# Altium schematic sheet VISION_BETA_EBB.SchDoc
size D; SheetNumber: 1; SheetTotal: 19
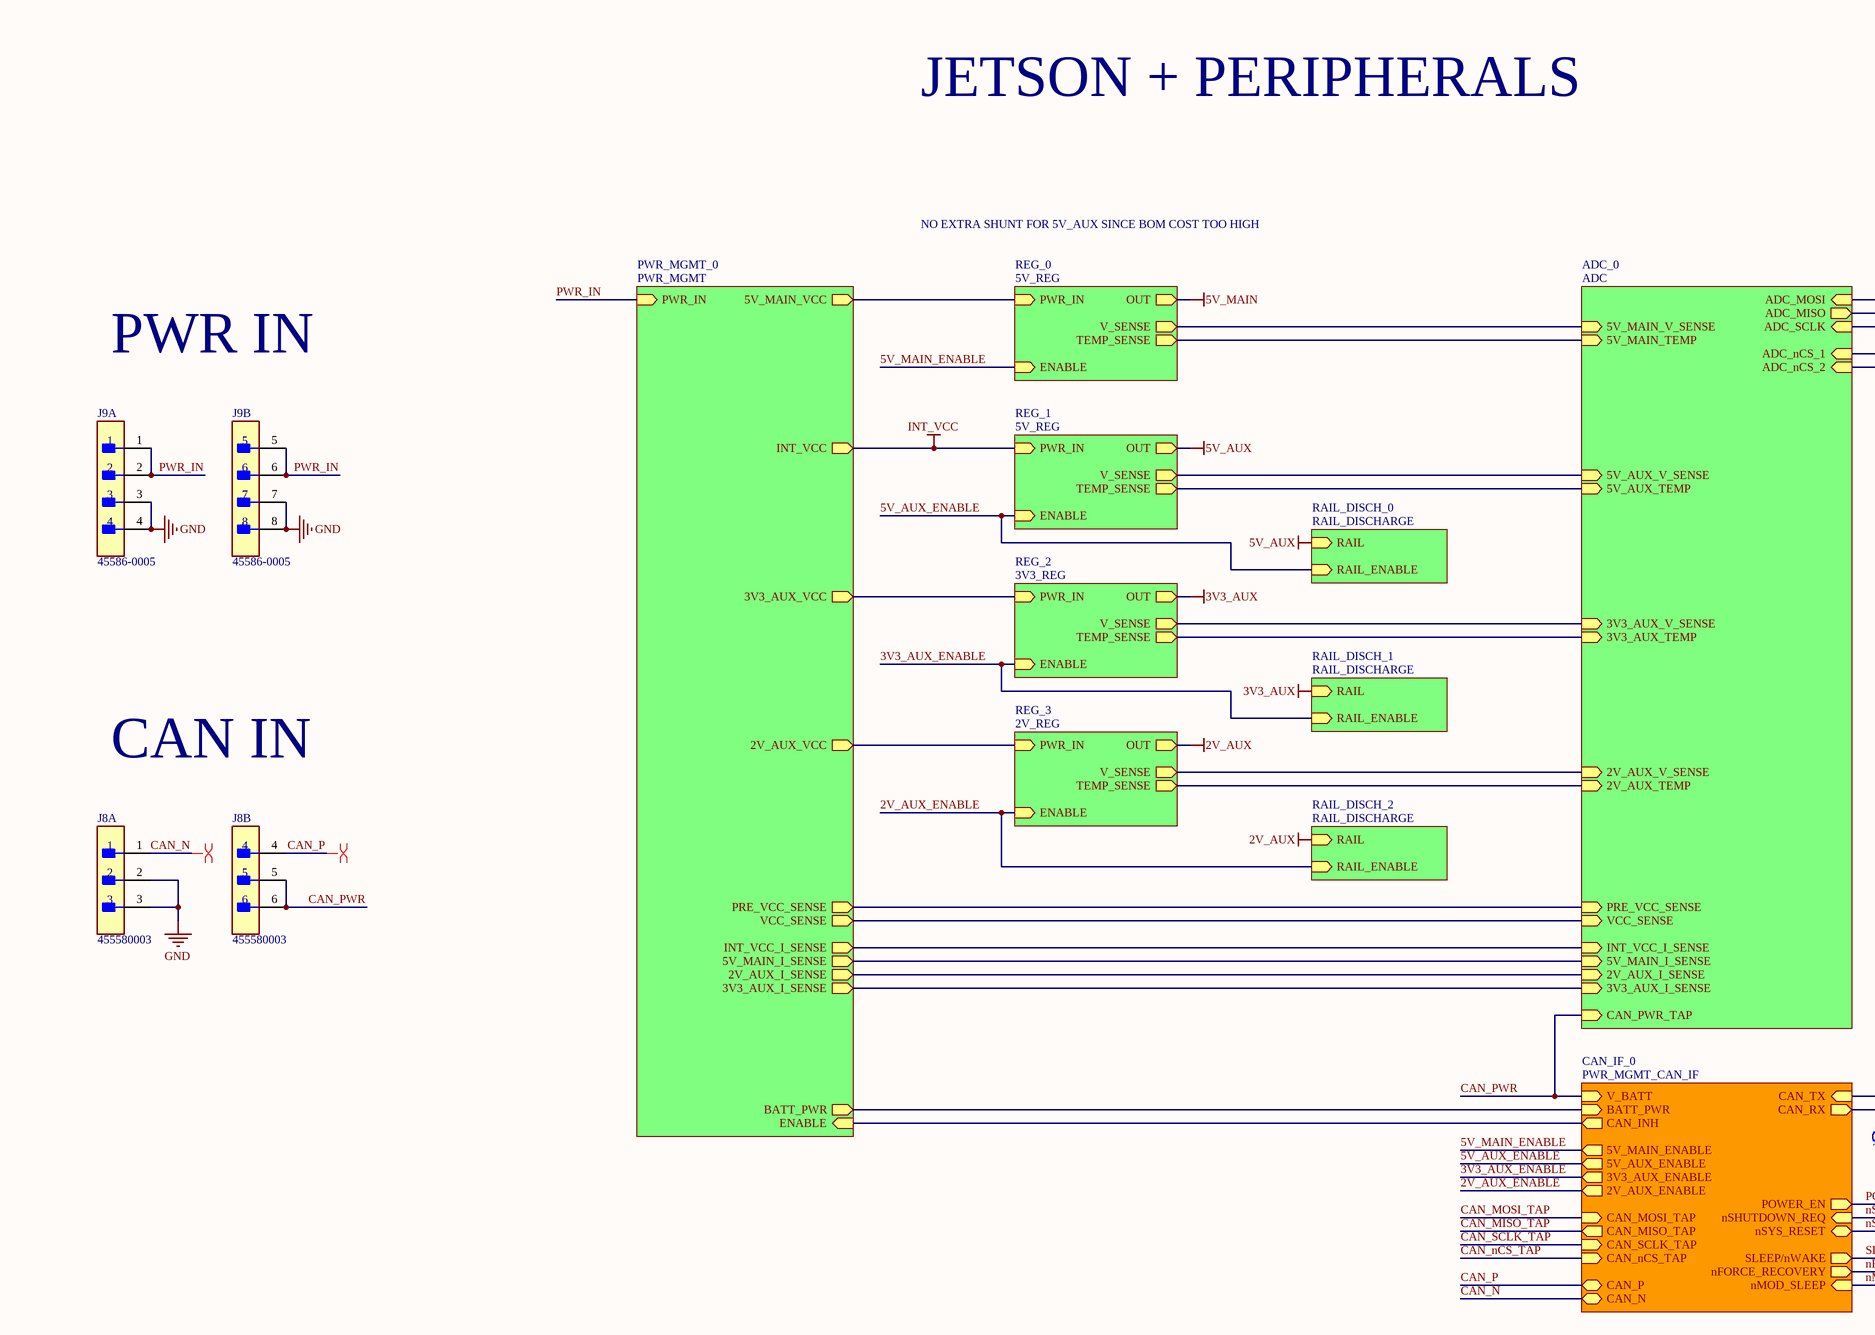
[diagram p0: VISION_BETA_EBB.SchDoc, top middle]
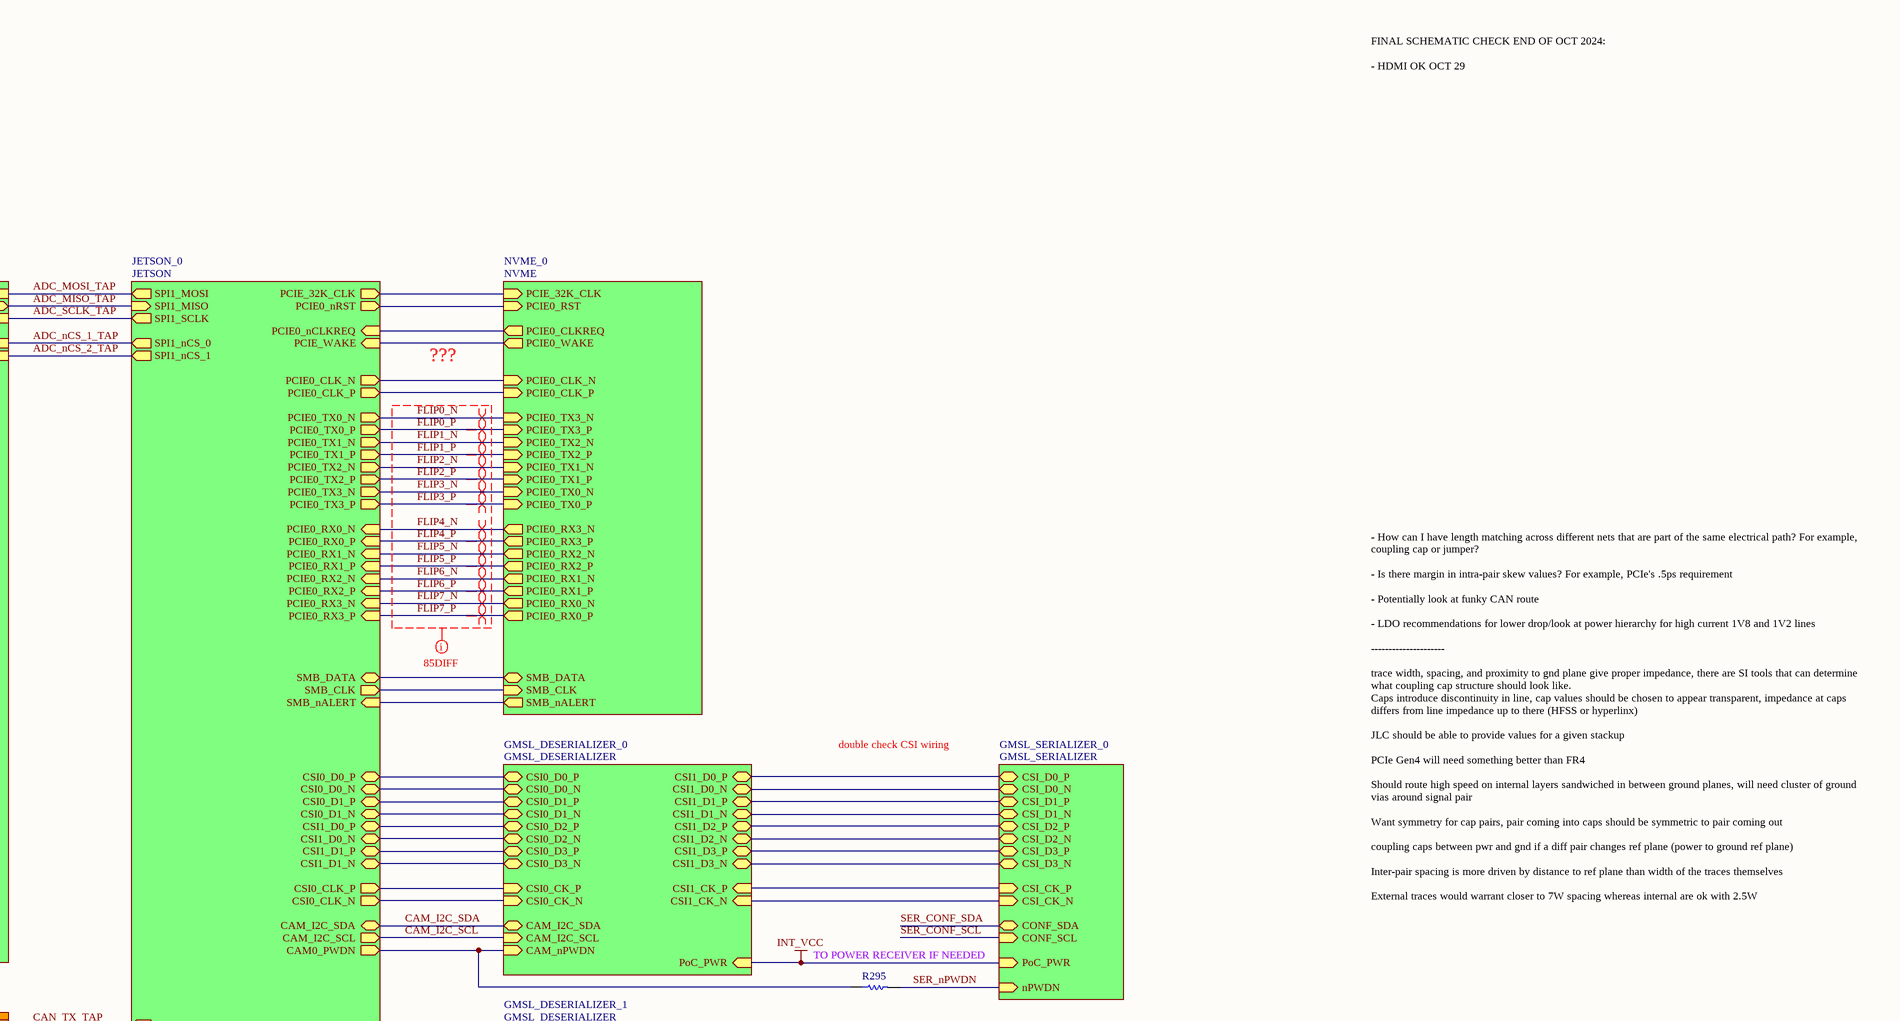
[diagram p1: VISION_BETA_EBB.SchDoc, top right]
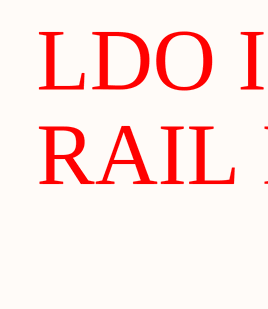
[diagram p2: VISION_BETA_EBB.SchDoc, bottom left]
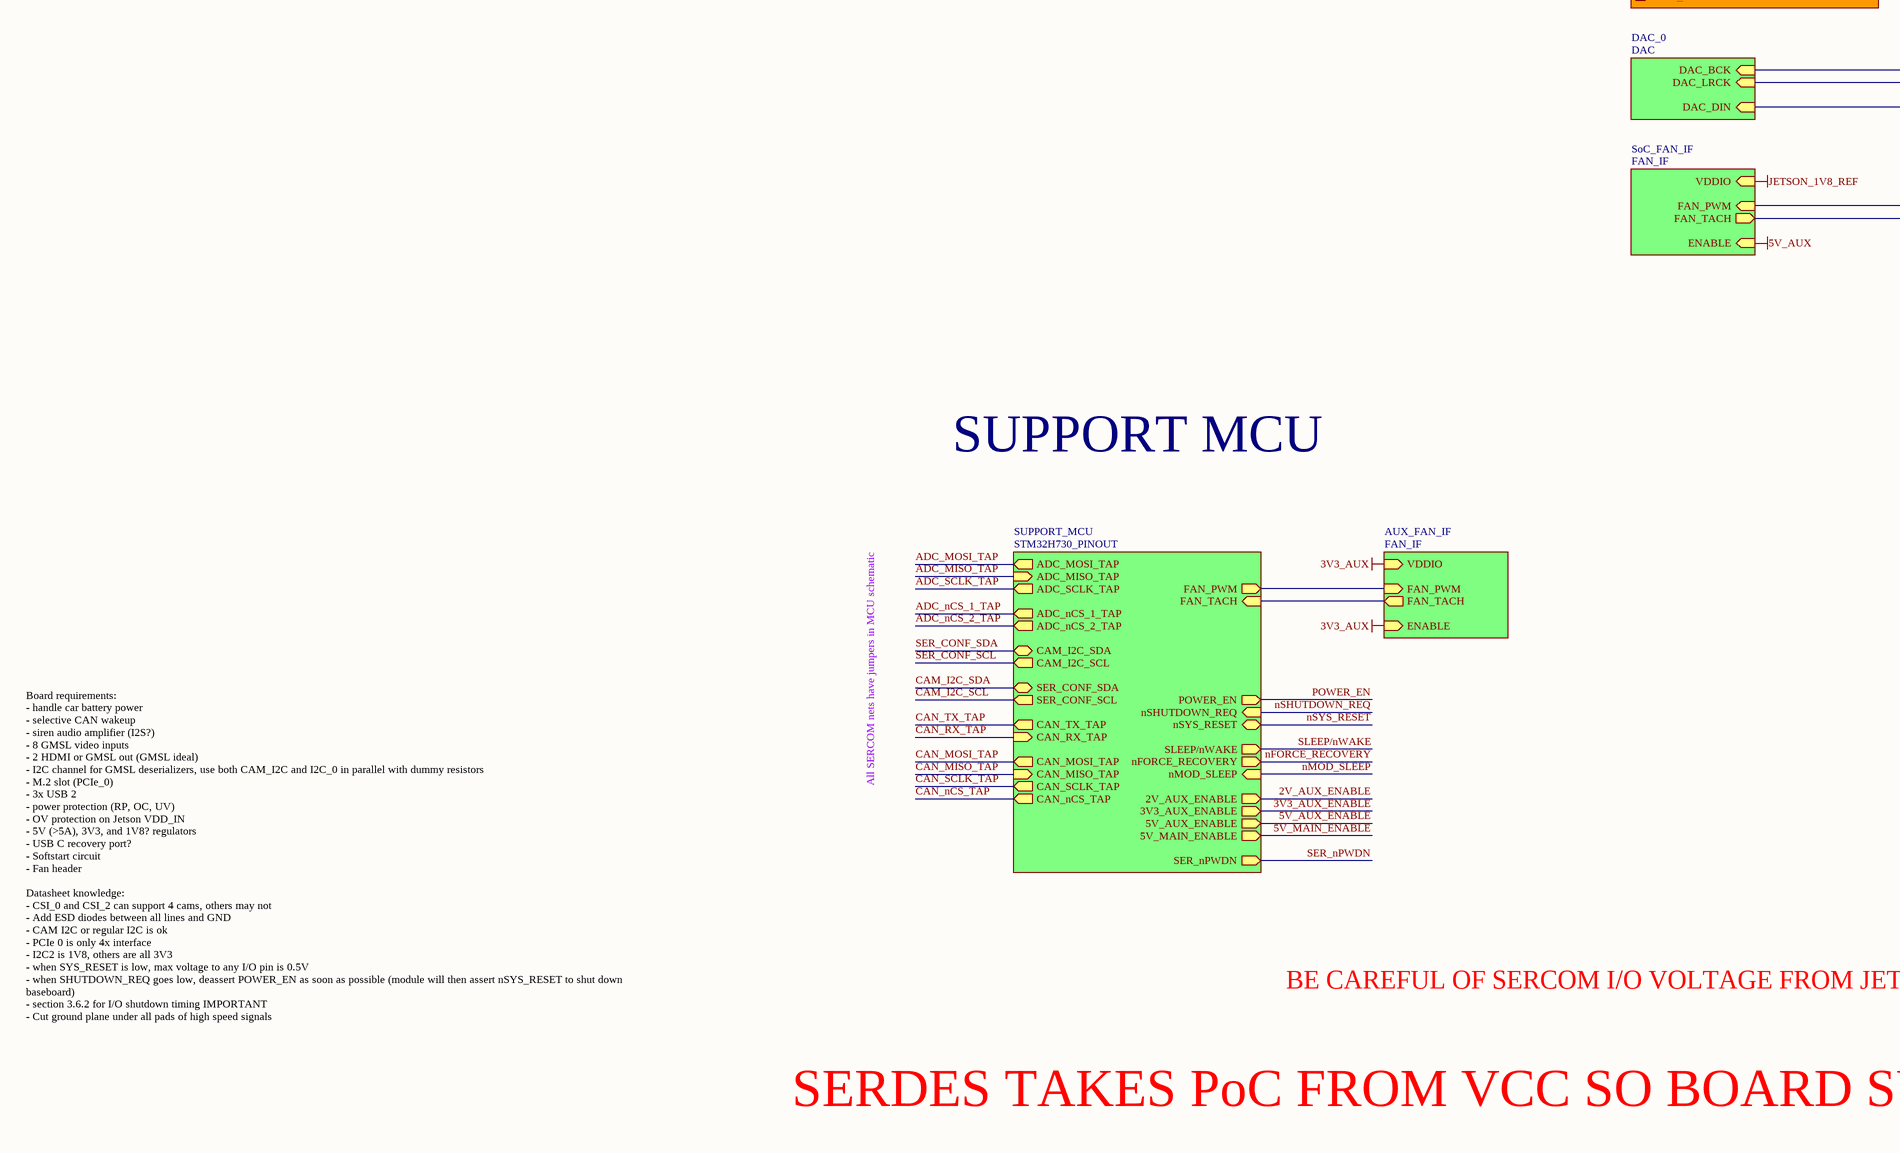
[diagram p3: VISION_BETA_EBB.SchDoc, bottom middle]
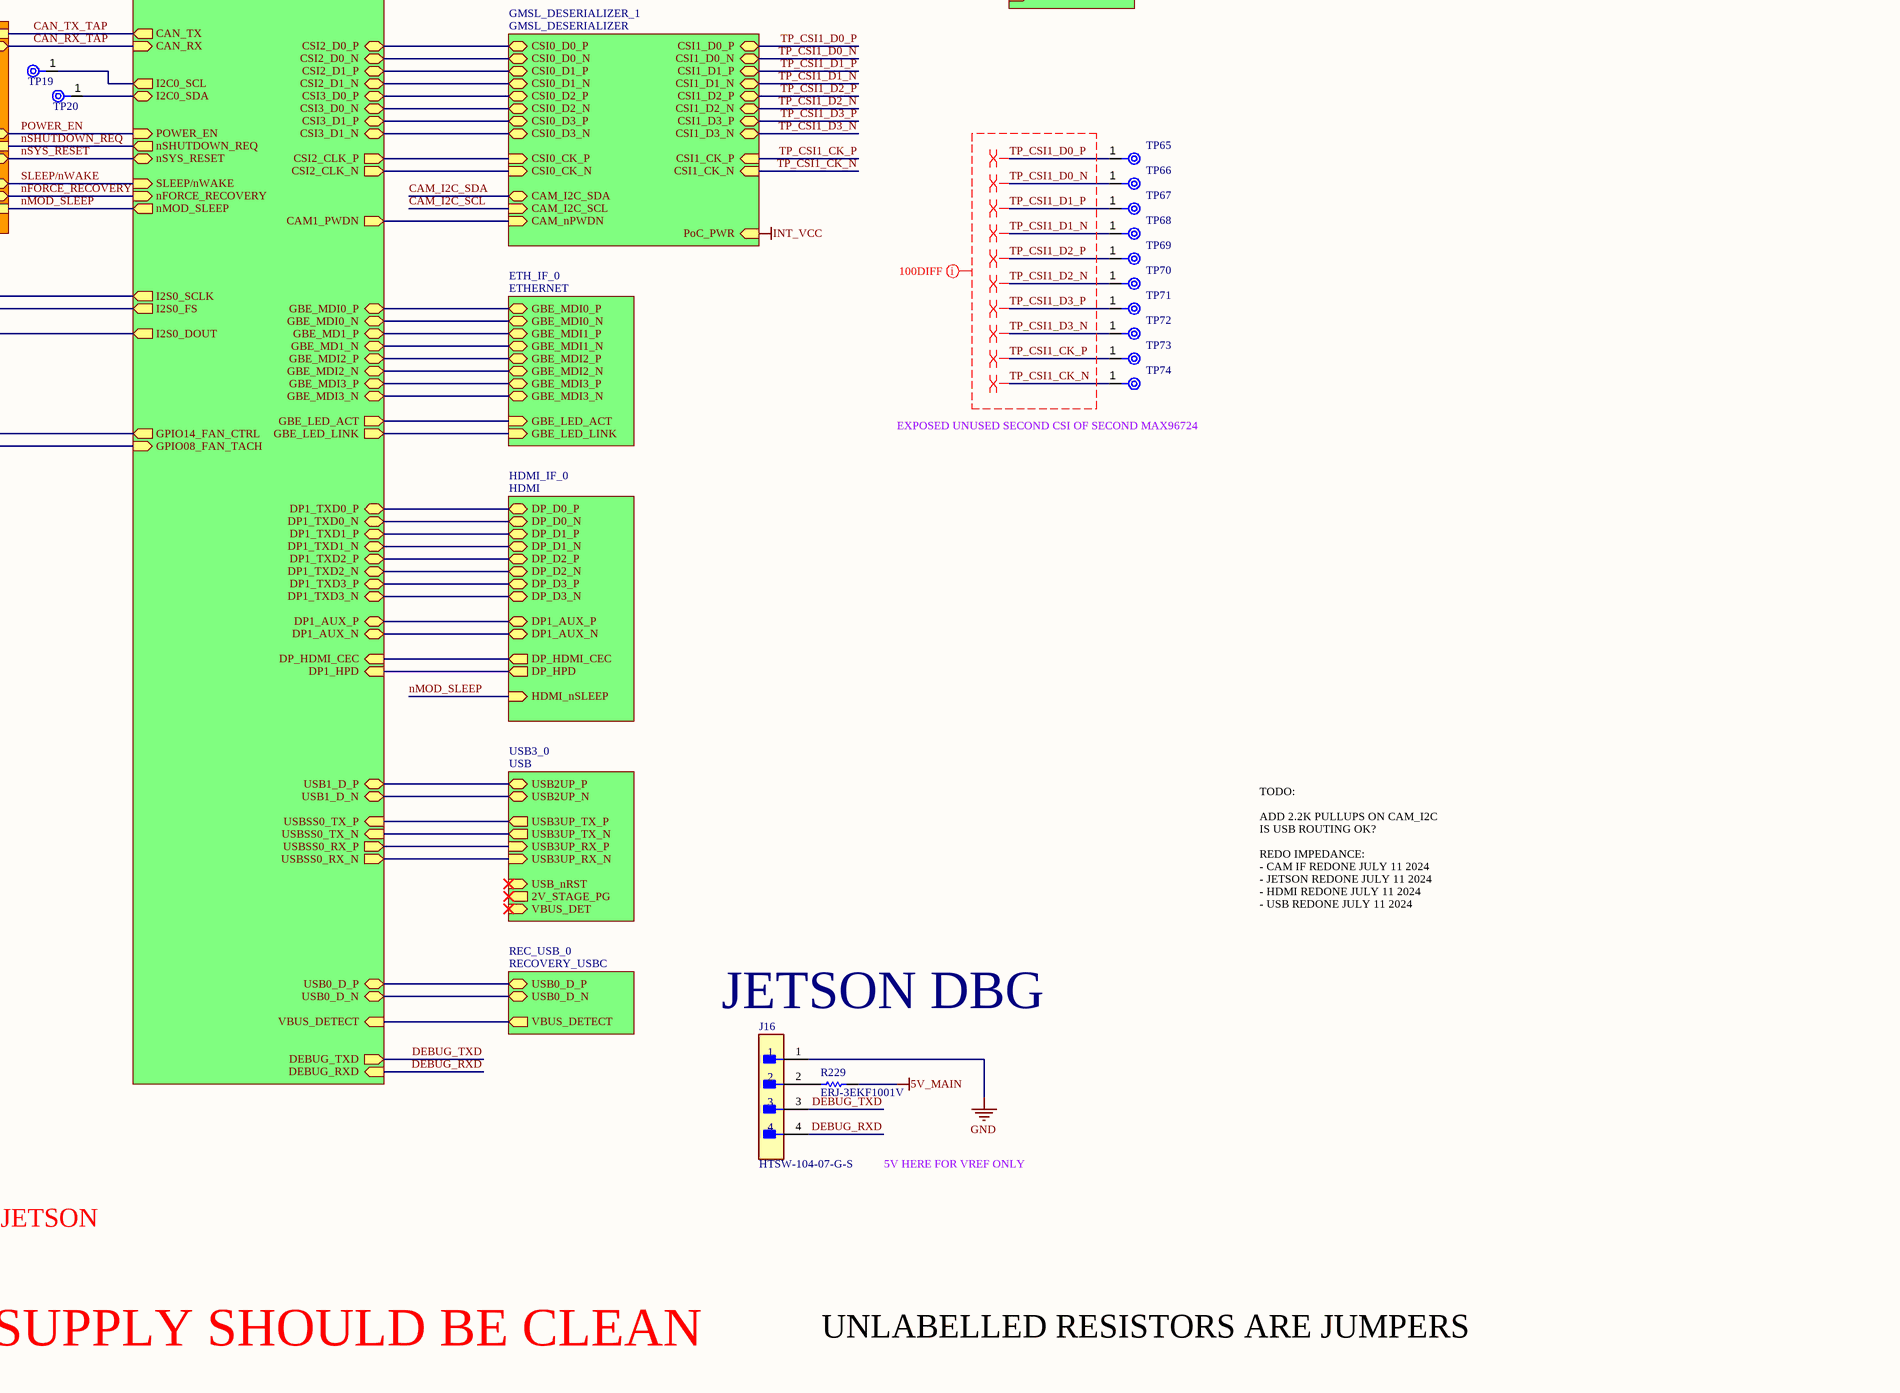
[diagram p4: VISION_BETA_EBB.SchDoc, bottom right]

## Parts
J8  455580003  [FP-455580003-MFG]  (parts A,B of 2)
J9  45586-0005  [FP-45586-0005-MFG]  (parts A,B of 2)
J16  HTSW-104-07-G-S  [FP-HTSW-104-07-G-S-MFG]
R229  ERJ-3EKF1001V  [RESC1608X55X30LL15T15]
R295  0402 JUMPER  [RESC1005X40X25ML05T05]  (value not drawn)
TP19  TPAD6R  [New footprint 1]  (value not drawn)
TP20  TPAD6R  [New footprint 1]  (value not drawn)
TP65  TPAD6R  [New footprint 1]  (value not drawn)
TP66  TPAD6R  [New footprint 1]  (value not drawn)
TP67  TPAD6R  [New footprint 1]  (value not drawn)
TP68  TPAD6R  [New footprint 1]  (value not drawn)
TP69  TPAD6R  [New footprint 1]  (value not drawn)
TP70  TPAD6R  [New footprint 1]  (value not drawn)
TP71  TPAD6R  [New footprint 1]  (value not drawn)
TP72  TPAD6R  [New footprint 1]  (value not drawn)
TP73  TPAD6R  [New footprint 1]  (value not drawn)
TP74  TPAD6R  [New footprint 1]  (value not drawn)

## Sub-sheets
ADC_0 = ADC: 5V_MAIN_V_SENSE (in), 3V3_AUX_V_SENSE (in), ADC_SCLK (in), ADC_MISO (out), ADC_MOSI (in), ADC_nCS_1 (in), ADC_nCS_2 (in), 2V_AUX_V_SENSE (in), 5V_AUX_V_SENSE (in), 5V_MAIN_TEMP (in), 5V_AUX_TEMP (in), 2V_AUX_TEMP (in), 3V3_AUX_TEMP (in), PRE_VCC_SENSE (in), VCC_SENSE (in), INT_VCC_I_SENSE (in), 5V_MAIN_I_SENSE (in), 2V_AUX_I_SENSE (in), 3V3_AUX_I_SENSE (in), CAN_PWR_TAP (in)
AUX_FAN_IF = FAN_IF: VDDIO (in), FAN_PWM (in), FAN_TACH (out), ENABLE (in)
CAN_IF_0 = PWR_MGMT_CAN_IF: CAN_TX (in), CAN_RX (out), CAN_INH (out), V_BATT (in), CAN_MOSI_TAP (in), CAN_MISO_TAP (out), CAN_SCLK_TAP (in), CAN_nCS_TAP (in), POWER_EN (out), nSHUTDOWN_REQ (in), nSYS_RESET (bidir), SLEEP/nWAKE (out), nFORCE_RECOVERY (out), nMOD_SLEEP (in), 5V_MAIN_ENABLE (out), 5V_AUX_ENABLE (out), 3V3_AUX_ENABLE (out), 2V_AUX_ENABLE (out), CAN_P (bidir), CAN_N (bidir), BATT_PWR (in)
DAC_0 = DAC: DAC_LRCK (in), DAC_BCK (in), DAC_DIN (in)
ETH_IF_0 = ETHERNET: GBE_MDI0_P (bidir), GBE_MDI0_N (bidir), GBE_MDI1_P (bidir), GBE_MDI1_N (bidir), GBE_MDI2_P (bidir), GBE_MDI2_N (bidir), GBE_MDI3_P (bidir), GBE_MDI3_N (bidir), GBE_LED_ACT (in), GBE_LED_LINK (in)
GMSL_DESERIALIZER_0 = GMSL_DESERIALIZER: CAM_I2C_SDA (bidir), CAM_I2C_SCL (in), PoC_PWR (in), CAM_nPWDN (in), CSI0_D0_P (bidir), CSI0_D0_N (bidir), CSI0_D1_P (bidir), CSI0_D1_N (bidir), CSI0_D2_P (bidir), CSI0_D2_N (bidir), CSI0_D3_P (bidir), CSI0_D3_N (bidir), CSI0_CK_P (in), CSI0_CK_N (in), CSI1_D0_P (bidir), CSI1_D0_N (bidir), CSI1_D1_P (bidir), CSI1_D1_N (bidir), CSI1_D2_P (bidir), CSI1_D2_N (bidir), CSI1_D3_P (bidir), CSI1_D3_N (bidir), CSI1_CK_P (in), CSI1_CK_N (in)
GMSL_DESERIALIZER_1 = GMSL_DESERIALIZER: CAM_I2C_SDA (bidir), CAM_I2C_SCL (in), PoC_PWR (in), CAM_nPWDN (in), CSI0_D0_P (bidir), CSI0_D0_N (bidir), CSI0_D1_P (bidir), CSI0_D1_N (bidir), CSI0_D2_P (bidir), CSI0_D2_N (bidir), CSI0_D3_P (bidir), CSI0_D3_N (bidir), CSI0_CK_P (in), CSI0_CK_N (in), CSI1_D0_P (bidir), CSI1_D0_N (bidir), CSI1_D1_P (bidir), CSI1_D1_N (bidir), CSI1_D2_P (bidir), CSI1_D2_N (bidir), CSI1_D3_P (bidir), CSI1_D3_N (bidir), CSI1_CK_P (in), CSI1_CK_N (in)
GMSL_SERIALIZER_0 = GMSL_SERIALIZER: CSI_D0_P (bidir), CSI_D0_N (bidir), CSI_D1_P (bidir), CSI_D1_N (bidir), CSI_D2_P (bidir), CSI_D2_N (bidir), CSI_D3_P (bidir), CSI_D3_N (bidir), CSI_CK_P (in), CSI_CK_N (in), CONF_SDA (bidir), CONF_SCL (in), nPWDN (in), PoC_PWR (in)
HDMI_IF_0 = HDMI: HDMI_nSLEEP (in), DP_D0_P (bidir), DP_D0_N (bidir), DP_D1_P (bidir), DP_D1_N (bidir), DP_D2_P (bidir), DP_D2_N (bidir), DP_D3_P (bidir), DP_D3_N (bidir), DP1_AUX_P (bidir), DP1_AUX_N (bidir), DP_HDMI_CEC (out), DP_HPD (out)
JETSON_0 = JETSON: PCIE0_RX0_N (in), PCIE0_RX0_P (in), PCIE0_RX1_N (in), PCIE0_RX1_P (in), PCIE0_RX2_N (in), PCIE0_RX2_P (in), PCIE0_RX3_N (in), PCIE0_RX3_P (in), PCIE0_TX0_N (out), PCIE0_TX0_P (out), PCIE0_TX1_N (out), PCIE0_TX1_P (out), PCIE0_TX2_N (out), PCIE0_TX2_P (out), PCIE0_TX3_N (out), PCIE0_TX3_P (out), PCIE0_CLK_N (out), PCIE0_CLK_P (out), CSI2_D0_N (bidir), CSI2_D0_P (bidir), CSI2_CLK_N (out), CSI2_CLK_P (out), CSI2_D1_N (bidir), CSI2_D1_P (bidir), CSI0_D0_N (bidir), CSI0_D0_P (bidir), CSI0_CLK_N (out), CSI0_CLK_P (out), CSI0_D1_N (bidir), CSI0_D1_P (bidir), CAM_I2C_SCL (out), CAM_I2C_SDA (bidir), CSI1_D0_N (bidir), CSI1_D0_P (bidir), CSI1_D1_N (bidir), CSI1_D1_P (bidir), CSI3_D0_N (bidir), CSI3_D0_P (bidir), CSI3_D1_N (bidir), CSI3_D1_P (bidir), DP1_TXD0_N (bidir), DP1_TXD0_P (bidir), DP1_TXD1_N (bidir), DP1_TXD1_P (bidir), DP1_TXD2_N (bidir), DP1_TXD2_P (bidir), DP1_TXD3_N (bidir), DP1_TXD3_P (bidir), DP1_AUX_N (bidir), DP1_AUX_P (bidir), DP_HDMI_CEC (in), DP1_HPD (in), PCIE_WAKE (in), PCIE0_nCLKREQ (in), PCIE0_nRST (out), CAM0_PWDN (out), CAM1_PWDN (out), CAN_RX (in), CAN_TX (out), PCIE_32K_CLK (out), SMB_DATA (bidir), SMB_CLK (out), SMB_nALERT (in), GBE_MDI0_N (bidir), GBE_MDI0_P (bidir), GBE_MD1_N (bidir), GBE_MD1_P (bidir), GBE_MDI2_N (bidir), GBE_MDI2_P (bidir), GBE_MDI3_N (bidir), GBE_MDI3_P (bidir), GBE_LED_ACT (out), GBE_LED_LINK (out), USB1_D_N (bidir), USB1_D_P (bidir), USBSS0_TX_N (in), USBSS0_TX_P (in), USBSS0_RX_N (out), USBSS0_RX_P (out), USB0_D_N (bidir), USB0_D_P (bidir), POWER_EN (in), nSHUTDOWN_REQ (out), nSYS_RESET (bidir), SLEEP/nWAKE (in), nFORCE_RECOVERY (in), nMOD_SLEEP (out), I2S0_DOUT (out), I2S0_FS (out), I2S0_SCLK (out), GPIO08_FAN_TACH (in), GPIO14_FAN_CTRL (out), VBUS_DETECT (in), I2C0_SCL (out), I2C0_SDA (bidir), DEBUG_TXD (out), DEBUG_RXD (in), SPI1_MOSI (out), SPI1_SCLK (out), SPI1_MISO (in), SPI1_nCS_0 (out), SPI1_nCS_1 (out)
NVME_0 = NVME: PCIE0_RST (in), PCIE0_CLKREQ (out), PCIE0_WAKE (out), PCIE0_CLK_N (in), PCIE0_CLK_P (in), PCIE_32K_CLK (in), PCIE0_TX3_N (in), PCIE0_TX3_P (in), PCIE0_TX2_N (in), PCIE0_TX2_P (in), PCIE0_TX1_N (in), PCIE0_TX1_P (in), PCIE0_TX0_N (in), PCIE0_TX0_P (in), PCIE0_RX3_N (out), PCIE0_RX3_P (out), PCIE0_RX2_N (out), PCIE0_RX2_P (out), PCIE0_RX1_N (out), PCIE0_RX1_P (out), PCIE0_RX0_N (out), PCIE0_RX0_P (out), SMB_DATA (bidir), SMB_CLK (in), SMB_nALERT (out)
PWR_MGMT_0 = PWR_MGMT: PWR_IN (in), INT_VCC (out), 5V_MAIN_VCC (out), 3V3_AUX_VCC (out), 2V_AUX_VCC (out), PRE_VCC_SENSE (out), VCC_SENSE (out), INT_VCC_I_SENSE (out), 5V_MAIN_I_SENSE (out), 2V_AUX_I_SENSE (out), 3V3_AUX_I_SENSE (out), ENABLE (in), BATT_PWR (out)
RAIL_DISCH_0 = RAIL_DISCHARGE: RAIL (in), RAIL_ENABLE (in)
RAIL_DISCH_1 = RAIL_DISCHARGE: RAIL (in), RAIL_ENABLE (in)
RAIL_DISCH_2 = RAIL_DISCHARGE: RAIL (in), RAIL_ENABLE (in)
REC_USB_0 = RECOVERY_USBC: USB0_D_N (bidir), USB0_D_P (bidir), VBUS_DETECT (out)
REG_0 = 5V_REG: PWR_IN (in), OUT (out), V_SENSE (out), ENABLE (in), TEMP_SENSE (out)
REG_1 = 5V_REG: OUT (out), PWR_IN (in), ENABLE (in), V_SENSE (out), TEMP_SENSE (out)
REG_2 = 3V3_REG: PWR_IN (in), OUT (out), V_SENSE (out), ENABLE (in), TEMP_SENSE (out)
REG_3 = 2V_REG: PWR_IN (in), OUT (out), V_SENSE (out), ENABLE (in), TEMP_SENSE (out)
SoC_FAN_IF = FAN_IF: FAN_PWM (in), FAN_TACH (out), VDDIO (in), ENABLE (in)
SUPPORT_MCU = STM32H730_PINOUT: FAN_PWM (out), FAN_TACH (in), CAM_I2C_SDA (bidir), CAM_I2C_SCL (out), SER_CONF_SDA (bidir), SER_CONF_SCL (out), CAN_TX_TAP (out), CAN_RX_TAP (in), CAN_MOSI_TAP (out), CAN_MISO_TAP (in), CAN_SCLK_TAP (out), CAN_nCS_TAP (out), ADC_nCS_2_TAP (out), ADC_nCS_1_TAP (out), ADC_SCLK_TAP (out), ADC_MISO_TAP (in), ADC_MOSI_TAP (out), POWER_EN (out), nSHUTDOWN_REQ (in), nSYS_RESET (bidir), SLEEP/nWAKE (out), nFORCE_RECOVERY (out), nMOD_SLEEP (in), SER_nPWDN (out), 2V_AUX_ENABLE (out), 3V3_AUX_ENABLE (out), 5V_AUX_ENABLE (out), 5V_MAIN_ENABLE (out)
USB3_0 = USB: USB2UP_N (bidir), USB2UP_P (bidir), USB3UP_RX_N (in), USB3UP_RX_P (in), USB3UP_TX_N (out), USB3UP_TX_P (out), VBUS_DET (in), USB_nRST (in), 2V_STAGE_PG (out)

## Nets
2V_AUX: sheet REG_3/OUT, sheet RAIL_DISCH_2/RAIL
3V3_AUX: sheet REG_2/OUT, sheet AUX_FAN_IF/VDDIO, sheet AUX_FAN_IF/ENABLE, sheet RAIL_DISCH_1/RAIL
5V_AUX: sheet SoC_FAN_IF/ENABLE, sheet REG_1/OUT, sheet RAIL_DISCH_0/RAIL
5V_MAIN: R229.1 ; sheet REG_0/OUT
GND: J8.2 J8.3 J9.3 J9.4 J9.7 J9.8 J16.1
INT_VCC: sheet GMSL_DESERIALIZER_0/PoC_PWR, sheet GMSL_DESERIALIZER_1/PoC_PWR, sheet PWR_MGMT_0/INT_VCC, sheet GMSL_SERIALIZER_0/PoC_PWR, sheet REG_1/PWR_IN
JETSON_1V8_REF: sheet SoC_FAN_IF/VDDIO
2V_AUX_ENABLE: sheet REG_3/ENABLE, sheet CAN_IF_0/2V_AUX_ENABLE, sheet SUPPORT_MCU/2V_AUX_ENABLE, sheet RAIL_DISCH_2/RAIL_ENABLE
3V3_AUX_ENABLE: sheet REG_2/ENABLE, sheet CAN_IF_0/3V3_AUX_ENABLE, sheet SUPPORT_MCU/3V3_AUX_ENABLE, sheet RAIL_DISCH_1/RAIL_ENABLE
5V_AUX_ENABLE: sheet CAN_IF_0/5V_AUX_ENABLE, sheet REG_1/ENABLE, sheet SUPPORT_MCU/5V_AUX_ENABLE, sheet RAIL_DISCH_0/RAIL_ENABLE
5V_MAIN_ENABLE: sheet REG_0/ENABLE, sheet CAN_IF_0/5V_MAIN_ENABLE, sheet SUPPORT_MCU/5V_MAIN_ENABLE
ADC_MISO_TAP: sheet JETSON_0/SPI1_MISO, sheet ADC_0/ADC_MISO, sheet SUPPORT_MCU/ADC_MISO_TAP
ADC_MOSI_TAP: sheet JETSON_0/SPI1_MOSI, sheet ADC_0/ADC_MOSI, sheet SUPPORT_MCU/ADC_MOSI_TAP
ADC_nCS_1_TAP: sheet JETSON_0/SPI1_nCS_0, sheet ADC_0/ADC_nCS_1, sheet SUPPORT_MCU/ADC_nCS_1_TAP
ADC_nCS_2_TAP: sheet JETSON_0/SPI1_nCS_1, sheet ADC_0/ADC_nCS_2, sheet SUPPORT_MCU/ADC_nCS_2_TAP
ADC_SCLK_TAP: sheet JETSON_0/SPI1_SCLK, sheet ADC_0/ADC_SCLK, sheet SUPPORT_MCU/ADC_SCLK_TAP
CAM_I2C_SCL: sheet JETSON_0/CAM_I2C_SCL, sheet GMSL_DESERIALIZER_0/CAM_I2C_SCL, sheet GMSL_DESERIALIZER_1/CAM_I2C_SCL, sheet SUPPORT_MCU/SER_CONF_SCL
CAM_I2C_SDA: sheet JETSON_0/CAM_I2C_SDA, sheet GMSL_DESERIALIZER_0/CAM_I2C_SDA, sheet GMSL_DESERIALIZER_1/CAM_I2C_SDA, sheet SUPPORT_MCU/SER_CONF_SDA
CAN_MISO_TAP: sheet CAN_IF_0/CAN_MISO_TAP, sheet SUPPORT_MCU/CAN_MISO_TAP
CAN_MOSI_TAP: sheet CAN_IF_0/CAN_MOSI_TAP, sheet SUPPORT_MCU/CAN_MOSI_TAP
CAN_N: J8.1 ; sheet CAN_IF_0/CAN_N
CAN_nCS_TAP: sheet CAN_IF_0/CAN_nCS_TAP, sheet SUPPORT_MCU/CAN_nCS_TAP
CAN_P: J8.4 ; sheet CAN_IF_0/CAN_P
CAN_PWR: J8.5 J8.6 ; sheet ADC_0/CAN_PWR_TAP, sheet CAN_IF_0/V_BATT
CAN_RX_TAP: sheet JETSON_0/CAN_RX, sheet CAN_IF_0/CAN_RX, sheet SUPPORT_MCU/CAN_RX_TAP
CAN_SCLK_TAP: sheet CAN_IF_0/CAN_SCLK_TAP, sheet SUPPORT_MCU/CAN_SCLK_TAP
CAN_TX_TAP: sheet JETSON_0/CAN_TX, sheet CAN_IF_0/CAN_TX, sheet SUPPORT_MCU/CAN_TX_TAP
DEBUG_RXD: J16.4 ; sheet JETSON_0/DEBUG_RXD
DEBUG_TXD: J16.3 ; sheet JETSON_0/DEBUG_TXD
FLIP0_N: sheet JETSON_0/PCIE0_TX0_N, sheet NVME_0/PCIE0_TX3_N
FLIP0_P: sheet JETSON_0/PCIE0_TX0_P, sheet NVME_0/PCIE0_TX3_P
FLIP1_N: sheet JETSON_0/PCIE0_TX1_N, sheet NVME_0/PCIE0_TX2_N
FLIP1_P: sheet JETSON_0/PCIE0_TX1_P, sheet NVME_0/PCIE0_TX2_P
FLIP2_N: sheet JETSON_0/PCIE0_TX2_N, sheet NVME_0/PCIE0_TX1_N
FLIP2_P: sheet JETSON_0/PCIE0_TX2_P, sheet NVME_0/PCIE0_TX1_P
FLIP3_N: sheet JETSON_0/PCIE0_TX3_N, sheet NVME_0/PCIE0_TX0_N
FLIP3_P: sheet JETSON_0/PCIE0_TX3_P, sheet NVME_0/PCIE0_TX0_P
FLIP4_N: sheet JETSON_0/PCIE0_RX0_N, sheet NVME_0/PCIE0_RX3_N
FLIP4_P: sheet JETSON_0/PCIE0_RX0_P, sheet NVME_0/PCIE0_RX3_P
FLIP5_N: sheet JETSON_0/PCIE0_RX1_N, sheet NVME_0/PCIE0_RX2_N
FLIP5_P: sheet JETSON_0/PCIE0_RX1_P, sheet NVME_0/PCIE0_RX2_P
FLIP6_N: sheet JETSON_0/PCIE0_RX2_N, sheet NVME_0/PCIE0_RX1_N
FLIP6_P: sheet JETSON_0/PCIE0_RX2_P, sheet NVME_0/PCIE0_RX1_P
FLIP7_N: sheet JETSON_0/PCIE0_RX3_N, sheet NVME_0/PCIE0_RX0_N
FLIP7_P: sheet JETSON_0/PCIE0_RX3_P, sheet NVME_0/PCIE0_RX0_P
nFORCE_RECOVERY: sheet JETSON_0/nFORCE_RECOVERY, sheet CAN_IF_0/nFORCE_RECOVERY, sheet SUPPORT_MCU/nFORCE_RECOVERY
nMOD_SLEEP: sheet JETSON_0/nMOD_SLEEP, sheet HDMI_IF_0/HDMI_nSLEEP, sheet CAN_IF_0/nMOD_SLEEP, sheet SUPPORT_MCU/nMOD_SLEEP
nSHUTDOWN_REQ: sheet JETSON_0/nSHUTDOWN_REQ, sheet CAN_IF_0/nSHUTDOWN_REQ, sheet SUPPORT_MCU/nSHUTDOWN_REQ
nSYS_RESET: sheet JETSON_0/nSYS_RESET, sheet CAN_IF_0/nSYS_RESET, sheet SUPPORT_MCU/nSYS_RESET
POWER_EN: sheet JETSON_0/POWER_EN, sheet CAN_IF_0/POWER_EN, sheet SUPPORT_MCU/POWER_EN
PWR_IN: J9.1 J9.2 J9.5 J9.6 ; sheet PWR_MGMT_0/PWR_IN
SER_CONF_SCL: sheet GMSL_SERIALIZER_0/CONF_SCL, sheet SUPPORT_MCU/CAM_I2C_SCL
SER_CONF_SDA: sheet GMSL_SERIALIZER_0/CONF_SDA, sheet SUPPORT_MCU/CAM_I2C_SDA
SER_nPWDN: R295.2 ; sheet GMSL_SERIALIZER_0/nPWDN, sheet SUPPORT_MCU/SER_nPWDN
SLEEP/nWAKE: sheet JETSON_0/SLEEP/nWAKE, sheet CAN_IF_0/SLEEP/nWAKE, sheet SUPPORT_MCU/SLEEP/nWAKE
TP_CSI1_CK_N: TP74.1(TP) ; sheet GMSL_DESERIALIZER_1/CSI1_CK_N
TP_CSI1_CK_P: TP73.1(TP) ; sheet GMSL_DESERIALIZER_1/CSI1_CK_P
TP_CSI1_D0_N: TP66.1(TP) ; sheet GMSL_DESERIALIZER_1/CSI1_D0_N
TP_CSI1_D0_P: TP65.1(TP) ; sheet GMSL_DESERIALIZER_1/CSI1_D0_P
TP_CSI1_D1_N: TP68.1(TP) ; sheet GMSL_DESERIALIZER_1/CSI1_D1_N
TP_CSI1_D1_P: TP67.1(TP) ; sheet GMSL_DESERIALIZER_1/CSI1_D1_P
TP_CSI1_D2_N: TP70.1(TP) ; sheet GMSL_DESERIALIZER_1/CSI1_D2_N
TP_CSI1_D2_P: TP69.1(TP) ; sheet GMSL_DESERIALIZER_1/CSI1_D2_P
TP_CSI1_D3_N: TP72.1(TP) ; sheet GMSL_DESERIALIZER_1/CSI1_D3_N
TP_CSI1_D3_P: TP71.1(TP) ; sheet GMSL_DESERIALIZER_1/CSI1_D3_P
NetJ16_2: J16.2 R229.2
NetR295_1: R295.1 ; sheet JETSON_0/CAM0_PWDN, sheet GMSL_DESERIALIZER_0/CAM_nPWDN
NetTP19_1: TP19.1(TP) ; sheet JETSON_0/I2C0_SCL
NetTP20_1: TP20.1(TP) ; sheet JETSON_0/I2C0_SDA
(unnamed): sheet JETSON_0/PCIE0_CLK_N, sheet NVME_0/PCIE0_CLK_N
(unnamed): sheet JETSON_0/PCIE0_CLK_P, sheet NVME_0/PCIE0_CLK_P
(unnamed): sheet JETSON_0/CSI2_D0_N, sheet GMSL_DESERIALIZER_1/CSI0_D0_N
(unnamed): sheet JETSON_0/CSI2_D0_P, sheet GMSL_DESERIALIZER_1/CSI0_D0_P
(unnamed): sheet JETSON_0/CSI2_CLK_N, sheet GMSL_DESERIALIZER_1/CSI0_CK_N
(unnamed): sheet JETSON_0/CSI2_CLK_P, sheet GMSL_DESERIALIZER_1/CSI0_CK_P
(unnamed): sheet JETSON_0/CSI2_D1_N, sheet GMSL_DESERIALIZER_1/CSI0_D1_N
(unnamed): sheet JETSON_0/CSI2_D1_P, sheet GMSL_DESERIALIZER_1/CSI0_D1_P
(unnamed): sheet JETSON_0/CSI0_D0_N, sheet GMSL_DESERIALIZER_0/CSI0_D0_N
(unnamed): sheet JETSON_0/CSI0_D0_P, sheet GMSL_DESERIALIZER_0/CSI0_D0_P
(unnamed): sheet JETSON_0/CSI0_CLK_N, sheet GMSL_DESERIALIZER_0/CSI0_CK_N
(unnamed): sheet JETSON_0/CSI0_CLK_P, sheet GMSL_DESERIALIZER_0/CSI0_CK_P
(unnamed): sheet JETSON_0/CSI0_D1_N, sheet GMSL_DESERIALIZER_0/CSI0_D1_N
(unnamed): sheet JETSON_0/CSI0_D1_P, sheet GMSL_DESERIALIZER_0/CSI0_D1_P
(unnamed): sheet JETSON_0/CSI1_D0_N, sheet GMSL_DESERIALIZER_0/CSI0_D2_N
(unnamed): sheet JETSON_0/CSI1_D0_P, sheet GMSL_DESERIALIZER_0/CSI0_D2_P
(unnamed): sheet JETSON_0/CSI1_D1_N, sheet GMSL_DESERIALIZER_0/CSI0_D3_N
(unnamed): sheet JETSON_0/CSI1_D1_P, sheet GMSL_DESERIALIZER_0/CSI0_D3_P
(unnamed): sheet JETSON_0/CSI3_D0_N, sheet GMSL_DESERIALIZER_1/CSI0_D2_N
(unnamed): sheet JETSON_0/CSI3_D0_P, sheet GMSL_DESERIALIZER_1/CSI0_D2_P
(unnamed): sheet JETSON_0/CSI3_D1_N, sheet GMSL_DESERIALIZER_1/CSI0_D3_N
(unnamed): sheet JETSON_0/CSI3_D1_P, sheet GMSL_DESERIALIZER_1/CSI0_D3_P
(unnamed): sheet JETSON_0/DP1_TXD0_N, sheet HDMI_IF_0/DP_D0_N
(unnamed): sheet JETSON_0/DP1_TXD0_P, sheet HDMI_IF_0/DP_D0_P
(unnamed): sheet JETSON_0/DP1_TXD1_N, sheet HDMI_IF_0/DP_D1_N
(unnamed): sheet JETSON_0/DP1_TXD1_P, sheet HDMI_IF_0/DP_D1_P
(unnamed): sheet JETSON_0/DP1_TXD2_N, sheet HDMI_IF_0/DP_D2_N
(unnamed): sheet JETSON_0/DP1_TXD2_P, sheet HDMI_IF_0/DP_D2_P
(unnamed): sheet JETSON_0/DP1_TXD3_N, sheet HDMI_IF_0/DP_D3_N
(unnamed): sheet JETSON_0/DP1_TXD3_P, sheet HDMI_IF_0/DP_D3_P
(unnamed): sheet JETSON_0/DP1_AUX_N, sheet HDMI_IF_0/DP1_AUX_N
(unnamed): sheet JETSON_0/DP1_AUX_P, sheet HDMI_IF_0/DP1_AUX_P
(unnamed): sheet JETSON_0/DP_HDMI_CEC, sheet HDMI_IF_0/DP_HDMI_CEC
(unnamed): sheet JETSON_0/DP1_HPD, sheet HDMI_IF_0/DP_HPD
(unnamed): sheet JETSON_0/PCIE_WAKE, sheet NVME_0/PCIE0_WAKE
(unnamed): sheet JETSON_0/PCIE0_nCLKREQ, sheet NVME_0/PCIE0_CLKREQ
(unnamed): sheet JETSON_0/PCIE0_nRST, sheet NVME_0/PCIE0_RST
(unnamed): sheet JETSON_0/CAM1_PWDN, sheet GMSL_DESERIALIZER_1/CAM_nPWDN
(unnamed): sheet JETSON_0/PCIE_32K_CLK, sheet NVME_0/PCIE_32K_CLK
(unnamed): sheet JETSON_0/SMB_DATA, sheet NVME_0/SMB_DATA
(unnamed): sheet JETSON_0/SMB_CLK, sheet NVME_0/SMB_CLK
(unnamed): sheet JETSON_0/SMB_nALERT, sheet NVME_0/SMB_nALERT
(unnamed): sheet JETSON_0/GBE_MDI0_N, sheet ETH_IF_0/GBE_MDI0_N
(unnamed): sheet JETSON_0/GBE_MDI0_P, sheet ETH_IF_0/GBE_MDI0_P
(unnamed): sheet JETSON_0/GBE_MD1_N, sheet ETH_IF_0/GBE_MDI1_N
(unnamed): sheet JETSON_0/GBE_MD1_P, sheet ETH_IF_0/GBE_MDI1_P
(unnamed): sheet JETSON_0/GBE_MDI2_N, sheet ETH_IF_0/GBE_MDI2_N
(unnamed): sheet JETSON_0/GBE_MDI2_P, sheet ETH_IF_0/GBE_MDI2_P
(unnamed): sheet JETSON_0/GBE_MDI3_N, sheet ETH_IF_0/GBE_MDI3_N
(unnamed): sheet JETSON_0/GBE_MDI3_P, sheet ETH_IF_0/GBE_MDI3_P
(unnamed): sheet JETSON_0/GBE_LED_ACT, sheet ETH_IF_0/GBE_LED_ACT
(unnamed): sheet JETSON_0/GBE_LED_LINK, sheet ETH_IF_0/GBE_LED_LINK
(unnamed): sheet JETSON_0/USB1_D_N, sheet USB3_0/USB2UP_N
(unnamed): sheet JETSON_0/USB1_D_P, sheet USB3_0/USB2UP_P
(unnamed): sheet JETSON_0/USBSS0_TX_N, sheet USB3_0/USB3UP_TX_N
(unnamed): sheet JETSON_0/USBSS0_TX_P, sheet USB3_0/USB3UP_TX_P
(unnamed): sheet JETSON_0/USBSS0_RX_N, sheet USB3_0/USB3UP_RX_N
(unnamed): sheet JETSON_0/USBSS0_RX_P, sheet USB3_0/USB3UP_RX_P
(unnamed): sheet JETSON_0/USB0_D_N, sheet REC_USB_0/USB0_D_N
(unnamed): sheet JETSON_0/USB0_D_P, sheet REC_USB_0/USB0_D_P
(unnamed): sheet JETSON_0/I2S0_DOUT, sheet DAC_0/DAC_DIN
(unnamed): sheet JETSON_0/I2S0_FS, sheet DAC_0/DAC_LRCK
(unnamed): sheet JETSON_0/I2S0_SCLK, sheet DAC_0/DAC_BCK
(unnamed): sheet JETSON_0/GPIO08_FAN_TACH, sheet SoC_FAN_IF/FAN_TACH
(unnamed): sheet JETSON_0/GPIO14_FAN_CTRL, sheet SoC_FAN_IF/FAN_PWM
(unnamed): sheet JETSON_0/VBUS_DETECT, sheet REC_USB_0/VBUS_DETECT
(unnamed): sheet GMSL_DESERIALIZER_0/CSI1_D0_P, sheet GMSL_SERIALIZER_0/CSI_D0_P
(unnamed): sheet GMSL_DESERIALIZER_0/CSI1_D0_N, sheet GMSL_SERIALIZER_0/CSI_D0_N
(unnamed): sheet GMSL_DESERIALIZER_0/CSI1_D1_P, sheet GMSL_SERIALIZER_0/CSI_D1_P
(unnamed): sheet GMSL_DESERIALIZER_0/CSI1_D1_N, sheet GMSL_SERIALIZER_0/CSI_D1_N
(unnamed): sheet GMSL_DESERIALIZER_0/CSI1_D2_P, sheet GMSL_SERIALIZER_0/CSI_D2_P
(unnamed): sheet GMSL_DESERIALIZER_0/CSI1_D2_N, sheet GMSL_SERIALIZER_0/CSI_D2_N
(unnamed): sheet GMSL_DESERIALIZER_0/CSI1_D3_P, sheet GMSL_SERIALIZER_0/CSI_D3_P
(unnamed): sheet GMSL_DESERIALIZER_0/CSI1_D3_N, sheet GMSL_SERIALIZER_0/CSI_D3_N
(unnamed): sheet GMSL_DESERIALIZER_0/CSI1_CK_P, sheet GMSL_SERIALIZER_0/CSI_CK_P
(unnamed): sheet GMSL_DESERIALIZER_0/CSI1_CK_N, sheet GMSL_SERIALIZER_0/CSI_CK_N
(unnamed): sheet PWR_MGMT_0/5V_MAIN_VCC, sheet REG_0/PWR_IN
(unnamed): sheet PWR_MGMT_0/3V3_AUX_VCC, sheet REG_2/PWR_IN
(unnamed): sheet PWR_MGMT_0/2V_AUX_VCC, sheet REG_3/PWR_IN
(unnamed): sheet PWR_MGMT_0/PRE_VCC_SENSE, sheet ADC_0/PRE_VCC_SENSE
(unnamed): sheet PWR_MGMT_0/VCC_SENSE, sheet ADC_0/VCC_SENSE
(unnamed): sheet PWR_MGMT_0/INT_VCC_I_SENSE, sheet ADC_0/INT_VCC_I_SENSE
(unnamed): sheet PWR_MGMT_0/5V_MAIN_I_SENSE, sheet ADC_0/5V_MAIN_I_SENSE
(unnamed): sheet PWR_MGMT_0/2V_AUX_I_SENSE, sheet ADC_0/2V_AUX_I_SENSE
(unnamed): sheet PWR_MGMT_0/3V3_AUX_I_SENSE, sheet ADC_0/3V3_AUX_I_SENSE
(unnamed): sheet PWR_MGMT_0/ENABLE, sheet CAN_IF_0/CAN_INH
(unnamed): sheet PWR_MGMT_0/BATT_PWR, sheet CAN_IF_0/BATT_PWR
(unnamed): sheet REG_0/V_SENSE, sheet ADC_0/5V_MAIN_V_SENSE
(unnamed): sheet REG_0/TEMP_SENSE, sheet ADC_0/5V_MAIN_TEMP
(unnamed): sheet REG_3/V_SENSE, sheet ADC_0/2V_AUX_V_SENSE
(unnamed): sheet REG_3/TEMP_SENSE, sheet ADC_0/2V_AUX_TEMP
(unnamed): sheet REG_2/V_SENSE, sheet ADC_0/3V3_AUX_V_SENSE
(unnamed): sheet REG_2/TEMP_SENSE, sheet ADC_0/3V3_AUX_TEMP
(unnamed): sheet ADC_0/5V_AUX_V_SENSE, sheet REG_1/V_SENSE
(unnamed): sheet ADC_0/5V_AUX_TEMP, sheet REG_1/TEMP_SENSE
(unnamed): sheet AUX_FAN_IF/FAN_PWM, sheet SUPPORT_MCU/FAN_PWM
(unnamed): sheet AUX_FAN_IF/FAN_TACH, sheet SUPPORT_MCU/FAN_TACH

## Layout directives
differential pair; differential pair class 120DIFF: CAN_N, CAN_P
differential pair: FLIP0_N, FLIP0_P, FLIP1_N, FLIP1_P, FLIP2_N, FLIP2_P, FLIP3_N, FLIP3_P, FLIP4_N, FLIP4_P, FLIP5_N, FLIP5_P, FLIP6_N, FLIP6_P, FLIP7_N, FLIP7_P, TP_CSI1_CK_N, TP_CSI1_CK_P, TP_CSI1_D0_N, TP_CSI1_D0_P, TP_CSI1_D1_N, TP_CSI1_D1_P, TP_CSI1_D2_N, TP_CSI1_D2_P, TP_CSI1_D3_N, TP_CSI1_D3_P
net class 85DIFF: FLIP0_N, FLIP0_P, FLIP1_N, FLIP1_P, FLIP2_N, FLIP2_P, FLIP3_N, FLIP3_P, FLIP4_N, FLIP4_P, FLIP5_N, FLIP5_P, FLIP6_N, FLIP6_P, FLIP7_N, FLIP7_P
net class 100DIFF: TP_CSI1_CK_N, TP_CSI1_CK_P, TP_CSI1_D0_N, TP_CSI1_D0_P, TP_CSI1_D1_N, TP_CSI1_D1_P, TP_CSI1_D2_N, TP_CSI1_D2_P, TP_CSI1_D3_N, TP_CSI1_D3_P

## Notes on the sheet
- JETSON + PERIPHERALS
- NO EXTRA SHUNT FOR 5V_AUX SINCE BOM COST TOO HIGH
- PWR IN
- ???
- FINAL SCHEMATIC CHECK END OF OCT 2024:
  - HDMI OK OCT 29
- CAN IN
- double check CSI wiring
- - How can I have length matching across different nets that are part of the same electrical path? For example, coupling cap or jumper?
  - Is there margin in intra-pair skew values? For example, PCIe's .5ps requirement
  - Potentially look at funky CAN route
  - LDO recommendations for lower drop/look at power hierarchy for high current 1V8 and 1V2 lines
  ---------------------
  trace width, spacing, and proximity to gnd plane give proper impedance, there are SI tools that can determine what coupling cap structure should look like.
  Caps introduce discontinuity in line, cap values should be chosen to appear transparent, impedance at caps differs from line impedance up to there (HFSS or hyperlinx)
  JLC should be able to provide values for a given stackup
  PCIe Gen4 will need something better than FR4
  Should route high speed on internal layers sandwiched in between ground planes, will need cluster of ground vias around signal pair
  Want symmetry for cap pairs, pair coming into caps should be symmetric to pair coming out
  coupling caps between pwr and gnd if a diff pair changes ref plane (power to ground ref plane)
  Inter-pair spacing is more driven by distance to ref plane than width of the traces themselves
  External traces would warrant closer to 7W spacing whereas internal are ok with 2.5W
- (near R295) TO POWER RECEIVER IF NEEDED
- LDO ISSUE
- (near TP74) EXPOSED UNUSED SECOND CSI OF SECOND MAX96724
- RAIL DISCHARGE ISSUE
- SUPPORT MCU
- All SERCOM nets have jumpers in MCU schematic
- (near J16) JETSON DBG
- 5V HERE FOR VREF ONLY
- TODO:
  ADD 2.2K PULLUPS ON CAM_I2C
  IS USB ROUTING OK?
  REDO IMPEDANCE:
  - CAM IF REDONE JULY 11 2024
  - JETSON REDONE JULY 11 2024
  - HDMI REDONE JULY 11 2024
  - USB REDONE JULY 11 2024
- BE CAREFUL OF SERCOM I/O VOLTAGE FROM JETSON
- Board requirements:
  - handle car battery power
  - selective CAN wakeup
  - siren audio amplifier (I2S?)
  - 8 GMSL video inputs
  - 2 HDMI or GMSL out (GMSL ideal)
  - I2C channel for GMSL deserializers, use both CAM_I2C and I2C_0 in parallel with dummy resistors
  - M.2 slot (PCIe_0)
  - 3x USB 2
  - power protection (RP, OC, UV)
  - OV protection on Jetson VDD_IN
  - 5V (>5A), 3V3, and 1V8? regulators
  - USB C recovery port?
  - Softstart circuit
  - Fan header
  Datasheet knowledge:
  - CSI_0 and CSI_2 can support 4 cams, others may not
  - Add ESD diodes between all lines and GND
  - CAM I2C or regular I2C is ok
  - PCIe 0 is only 4x interface
  - I2C2 is 1V8, others are all 3V3
  - when SYS_RESET is low, max voltage to any I/O pin is 0.5V
  - when SHUTDOWN_REQ goes low, deassert POWER_EN as soon as possible (module will then assert nSYS_RESET to shut down baseboard)
  - section 3.6.2 for I/O shutdown timing IMPORTANT
  - Cut ground plane under all pads of high speed signals
- SERDES TAKES PoC FROM VCC SO BOARD SUPPLY SHOULD BE CLEAN
- UNLABELLED RESISTORS ARE JUMPERS

## Library data of the parts
J8 = CMP-04776-000024-1: CONN HEADER R/A 6POS 4.2MM; Manufacturer: Molex; Standoff Height: 0.4mm; Conn Orientation: Right Angle; Number Of Contacts: 6; Conn Gender: Male; Voltage Rating: 600V; Current Rating: 8A; Footprint Url: https://www.molex.com/pdm_docs/sd/455580003_sd.pdf; Number Of Rows: 2; Lead Free: Yes; Digikey Description: CONN HEADER R/A 6POS 4.2MM; ComponentLink2URL: https://www.molex.com/webdocs/datasheets/pdf/en-us/0455580003_PCB_HEADERS.pdf; Octopart: https://octopart.com/45558-0003-molex-7672845; Package: 0; Device Class L3: unset; ComponentLink2Description: Datasheet; Device Class L2: Headers and Wire Housings; Category: Conn; Contact Material: Tin,Nickel; Mouser Description: Conn Power HDR 6 POS 4.2mm Solder ST Thru-Hole 6 Terminal 1 Port Mini-Fit Jr™ Tray; Manufacturer Part Number: 455580003; Pitch: 4.2mm; Device Class L1: Connectors; Temperature Range Low: -40°C; Temperature: -40°C to +105°C; RoHS: TRUE; Temperature Range High: +105°C; Height: 10.38mm; Automotive: No
J9 = CMP-04776-000690-1: CONN HEADER R/A 8POS 4.2MM
J16 = CMP-02766-001776-1: CONN HEADER VERT 4POS 2.54MM; Gender: Male; Number of Contacts: 4; Packaging: Bulk; RoHS Compliant: Yes; Number of Rows: 1; Mount: Through Hole; Contact Material: Bronze; Series: HTSW; Radiation Hardening: No; Pitch: 2.54mm; Reach SVHC Compliant: Yes; Contact Plating: Gold; Termination: Through Hole
R229 = CMP-2000-00180-1: Manufacturer: Panasonic; Part Number: ERJ-3EKF1001V
R295 = CMP-009-00118-2: READ THE NAME; Pins: 2; Component Type: Standard; Design Item ID: CMP-009-00206-2; Source: 0402jump.SchLib
TP19 TP20 TP65-TP74 = CMP-00025-2: Test Point .6mm